# Altium schematic sheet ITDB02.SchDoc
size A
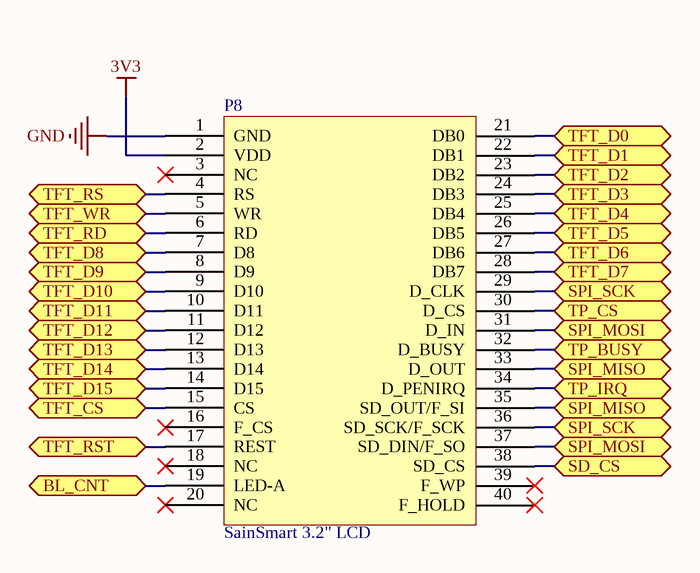
[diagram p0: ITDB02.SchDoc]

## Parts
P8  SainSmart 3.2" LCD  [HDR2x20]

## Ports
BL_CNT, SD_CS, SPI_MISO, SPI_MOSI, SPI_SCK, TFT_CS, TFT_D0, TFT_D1, TFT_D2, TFT_D3, TFT_D4, TFT_D5, TFT_D6, TFT_D7, TFT_D8, TFT_D9, TFT_D10, TFT_D11, TFT_D12, TFT_D13, TFT_D14, TFT_D15, TFT_RD, TFT_RS, TFT_RST, TFT_WR, TP_BUSY, TP_CS, TP_IRQ

## Nets
3V3: P8.2(VDD)
GND: P8.1(GND)
BL_CNT: P8.19(LED-A) ; port BL_CNT
SD_CS: P8.38(SD_CS) ; port SD_CS
SPI_MISO: P8.33(D_OUT) P8.35(SD_OUT/F_SI) ; port SPI_MISO
SPI_MOSI: P8.31(D_IN) P8.37(SD_DIN/F_SO) ; port SPI_MOSI
SPI_SCK: P8.29(D_CLK) P8.36(SD_SCK/F_SCK) ; port SPI_SCK
TFT_CS: P8.15(CS) ; port TFT_CS
TFT_D0: P8.21(DB0) ; port TFT_D0
TFT_D1: P8.22(DB1) ; port TFT_D1
TFT_D2: P8.23(DB2) ; port TFT_D2
TFT_D3: P8.24(DB3) ; port TFT_D3
TFT_D4: P8.25(DB4) ; port TFT_D4
TFT_D5: P8.26(DB5) ; port TFT_D5
TFT_D6: P8.27(DB6) ; port TFT_D6
TFT_D7: P8.28(DB7) ; port TFT_D7
TFT_D8: P8.7(D8) ; port TFT_D8
TFT_D9: P8.8(D9) ; port TFT_D9
TFT_D10: P8.9(D10) ; port TFT_D10
TFT_D11: P8.10(D11) ; port TFT_D11
TFT_D12: P8.11(D12) ; port TFT_D12
TFT_D13: P8.12(D13) ; port TFT_D13
TFT_D14: P8.13(D14) ; port TFT_D14
TFT_D15: P8.14(D15) ; port TFT_D15
TFT_RD: P8.6(RD) ; port TFT_RD
TFT_RS: P8.4(RS) ; port TFT_RS
TFT_RST: P8.17(REST) ; port TFT_RST
TFT_WR: P8.5(WR) ; port TFT_WR
TP_BUSY: P8.32(D_BUSY) ; port TP_BUSY
TP_CS: P8.30(D_CS) ; port TP_CS
TP_IRQ: P8.34(D_PENIRQ) ; port TP_IRQ

Not connected (* = marked no-connect by the designer): P8 3(NC)* 16(F_CS)* 18(NC)* 20(NC)* 39(F_WP)* 40(F_HOLD)*

## Library data of the parts
P8 = SainSmart 3.2" LCD: Supplier 1: Digi-Key; Supplier Part Number 1: S9200-ND